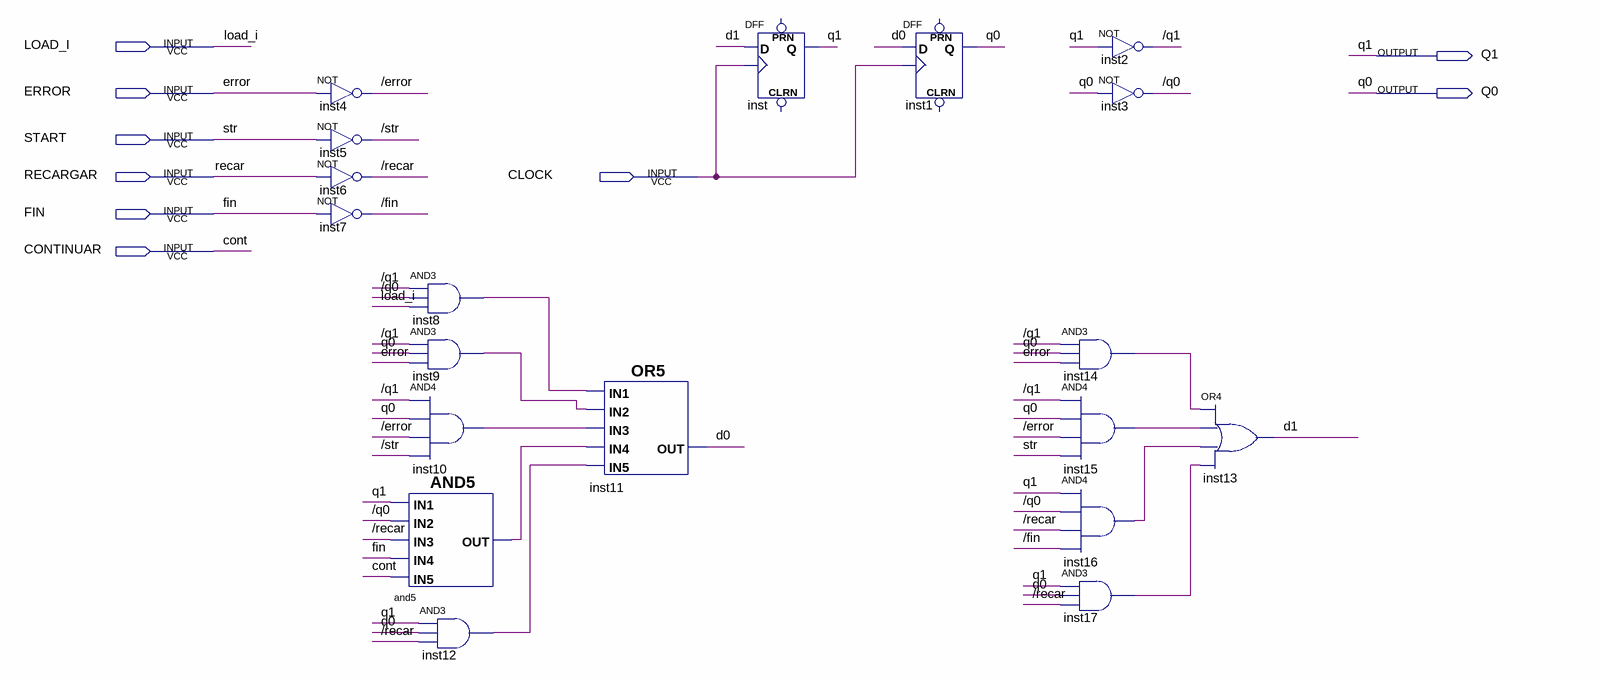
[diagram p0: schematic sheet]
// Quartus schematic maquinaE.bdf as structural Verilog: 19 symbols, 9 pins
module maquinaE (
  input  LOAD_I,
  input  ERROR,
  input  START,
  input  RECARGAR,
  input  CLOCK,
  input  FIN,
  input  CONTINUAR,
  output Q1,
  output Q0
);

  wire \/error , \/fin , \/q0 , \/q1 , \/recar , \/str , and5_out, d0, d1, inst8_out, inst9_out, inst10_out,
       inst12_out, inst14_out, inst15_out, inst16_out, inst17_out;

  not inst4 (\/error , ERROR);
  not inst5 (\/str , START);
  not inst6 (\/recar , RECARGAR);
  not inst7 (\/fin , FIN);
  and inst8 (inst8_out, \/q1 , \/q0 , LOAD_I);
  and inst9 (inst9_out, \/q1 , Q0, ERROR);
  and inst10 (inst10_out, \/q1 , Q0, \/error , \/str );
  and and5 (and5_out, Q1, \/q0 , \/recar , FIN, CONTINUAR);
  and inst12 (inst12_out, Q1, Q0, \/recar );
  or inst11 (d0, inst8_out, inst9_out, inst10_out, and5_out, inst12_out);
  DFF inst (.CLK(CLOCK), .D(d1), .Q(Q1));  // open: CLRN, PRN
  DFF inst1 (.CLK(CLOCK), .D(d0), .Q(Q0));  // open: CLRN, PRN
  and inst14 (inst14_out, \/q1 , Q0, ERROR);
  and inst15 (inst15_out, \/q1 , Q0, \/error , START);
  and inst16 (inst16_out, Q1, \/q0 , \/recar , \/fin );
  and inst17 (inst17_out, Q1, Q0, \/recar );
  not inst2 (\/q1 , Q1);
  not inst3 (\/q0 , Q0);
  or inst13 (d1, inst14_out, inst15_out, inst16_out, inst17_out);

  // Other names for the same wires on the sheet: cont = CONTINUAR; recar = RECARGAR; str = START
endmodule
